# EAGLE schematic rs-485-multiplier-v2-9 (EAGLE 6.4)
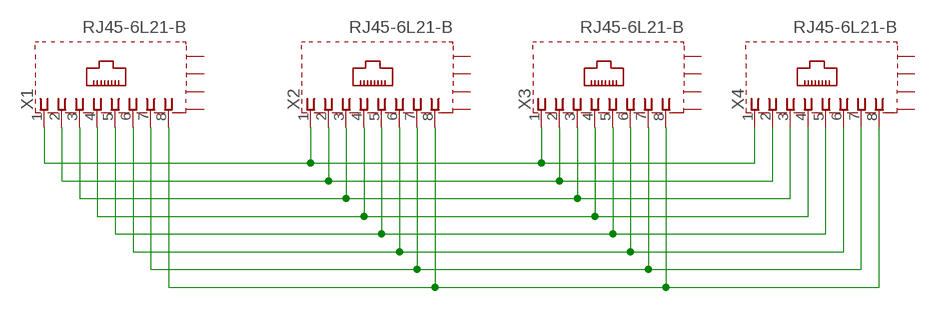
[diagram p0: schematic, sheet 1]

## Parts
X1  RJ45-6L21-B  [RJ45-SHIELD1]
X2  RJ45-6L21-B  [RJ45-SHIELD1]
X3  RJ45-6L21-B  [RJ45-SHIELD1]
X4  RJ45-6L21-B  [RJ45-SHIELD1]

## Nets
N$1: X1.1 X2.1 X3.1 X4.1
N$2: X1.2 X2.2 X3.2 X4.2
N$3: X1.3 X2.3 X3.3 X4.3
N$4: X1.4 X2.4 X3.4 X4.4
N$5: X1.5 X2.5 X3.5 X4.5
N$6: X1.6 X2.6 X3.6 X4.6
N$7: X1.7 X2.7 X3.7 X4.7
N$8: X1.8 X2.8 X3.8 X4.8
Unconnected: X1.S1(S) X1.S2(S) X1.S3(S) X1.S4(S) X2.S1(S) X2.S2(S) X2.S3(S) X2.S4(S) X3.S1(S) X3.S2(S) X3.S3(S) X3.S4(S) X4.S1(S) X4.S2(S) X4.S3(S) X4.S4(S)

## Library data of the parts
X1-X4 = con-tycoelectronics:RJ45*2: RJ45 Low Profile Shield Type 2 For all RJ45 L, LC, LCT and X Series Models Source: www.tycoelectronics.com .. ENG_DS_1654001_1099_RJ_L_0507.pdf; OC_FARNELL: unknown; OC_NEWARK: unknown